# EAGLE design Oscillator_RevA (EAGLE 7.1.0)
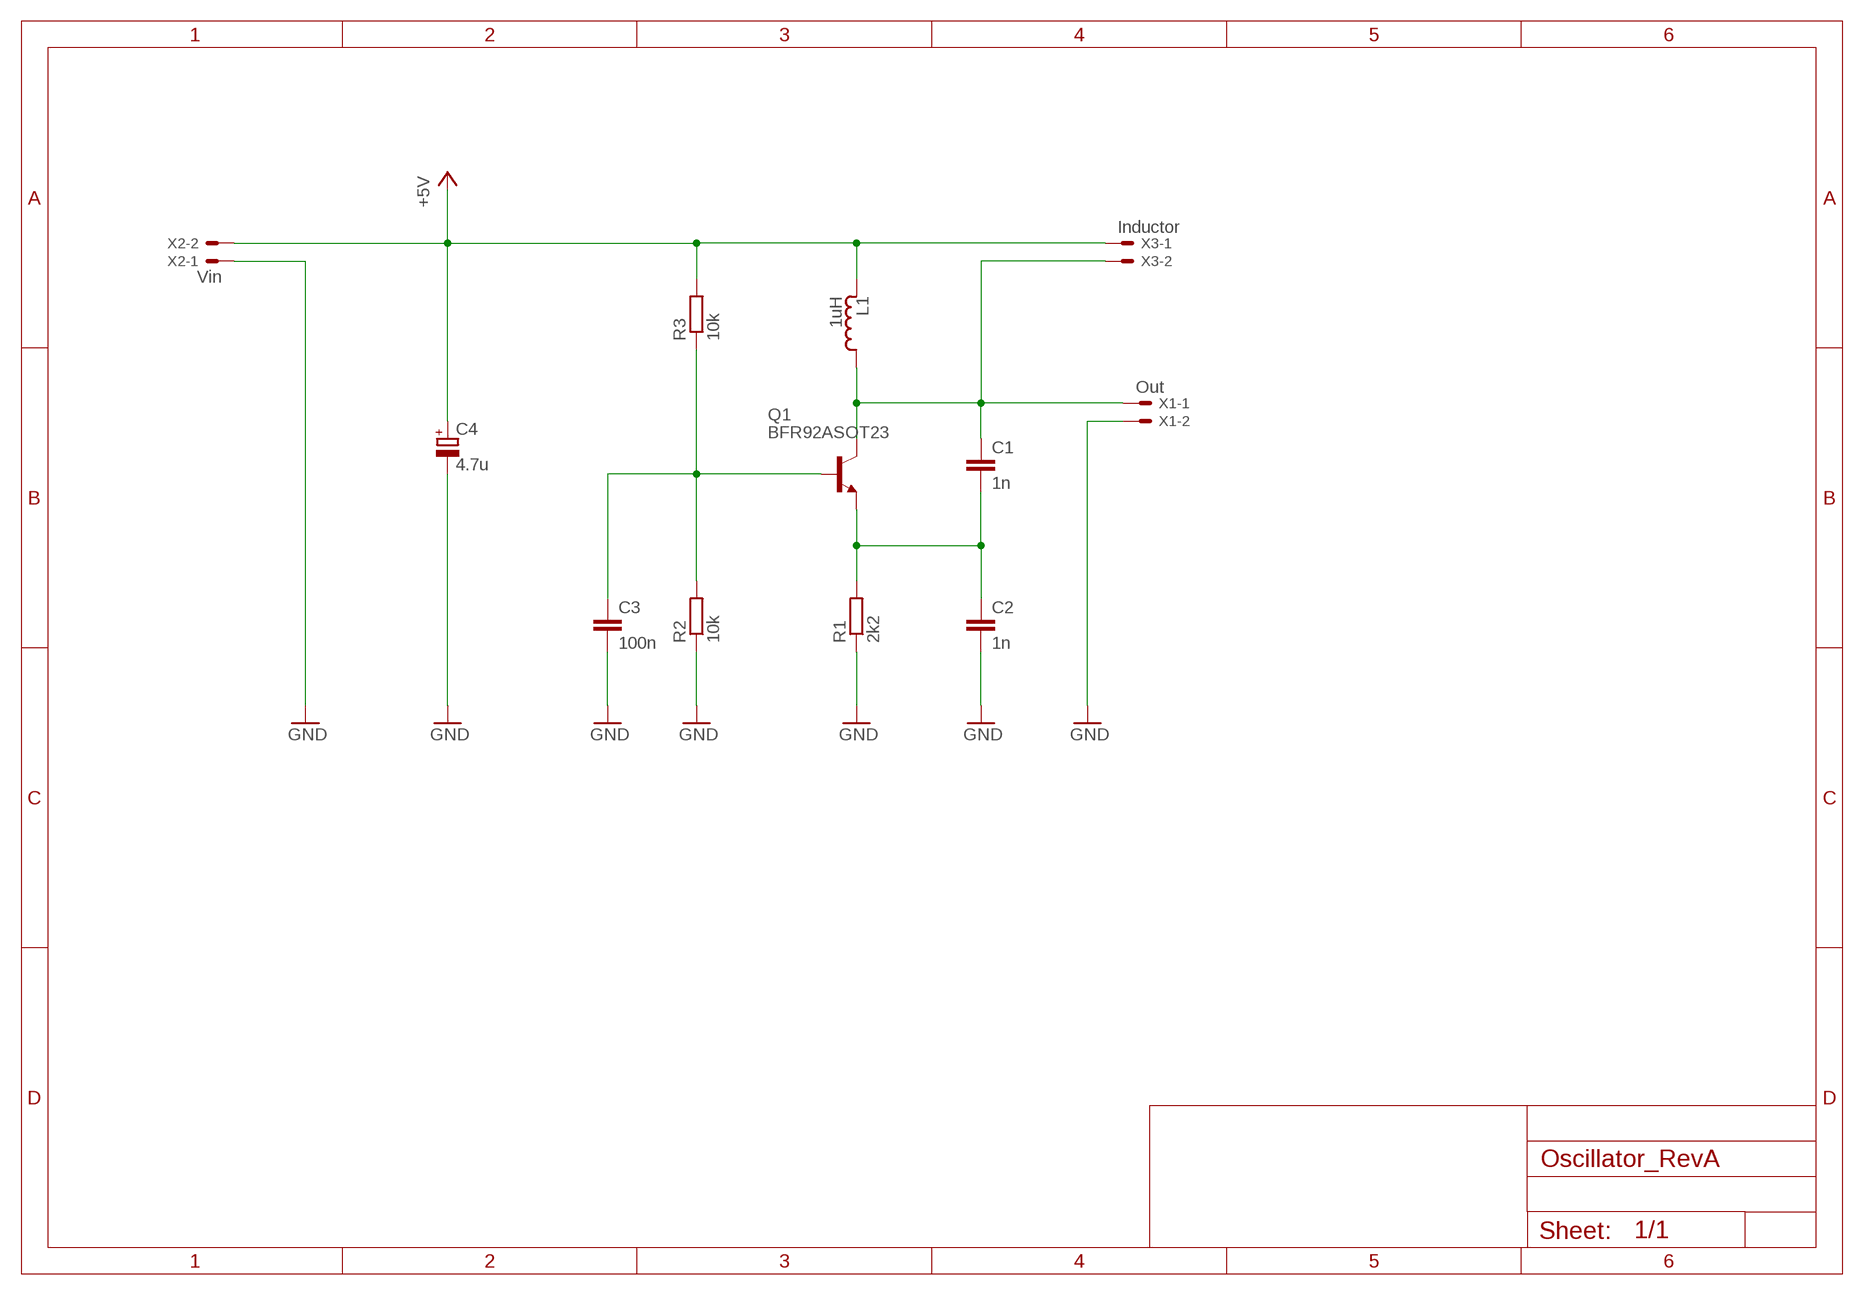
[diagram p0: schematic, sheet 1]

## Parts
C1  1n  CC0805  [C0805]
C2  1n  CC0805  [C0805]
C3  100n  CC0805  [C0805]
C4  4.7u  C_POLARIZEDSMC_C  [SMC_C]
L1  1uH  INDUCTOR4.3MM  [LPS4414]
Q1  BFR92ASOT23  [SOT23]
R1  2k2  RESISTORR0805  [R0805]
R2  10k  RESISTORR0805  [R0805]
R3  10k  RESISTORR0805  [R0805]
X1  Out  22-23-2021100MIL  [22-23-2021]
X2  Vin  22-23-2021100MIL  [22-23-2021]
X3  Inductor  22-23-2021100MIL  [22-23-2021]

## Nets
+5V: C4.+ L1.2 R3.2 X2.2 X3.1
GND: C2.2 C3.2 C4.- R1.1 R2.1 X1.2 X2.1
N$1: C1.1 L1.1 Q1.3(C) X1.1 X3.2
N$2: C1.2 C2.1 Q1.2(E) R1.2
N$3: C3.1 Q1.1(B) R2.2 R3.1

## Library data of the parts
C1-C3 = 00Capacitor:C: Capacitor
C4 = 00Capacitor:C_POLARIZED
L1 = 00Inductor:INDUCTOR
Q1 = 00Transistor:BFR92A
R1-R3 = 00Resistor:RESISTOR: RESISTOR, European symbol
X1-X3 = 00Connector:22-23-2021: .100" (2.54mm) Center Header - 2 Pin; MF: MOLEX; MPN: 22-23-2021; OC_FARNELL: 1462926; OC_NEWARK: 25C3832

## Board
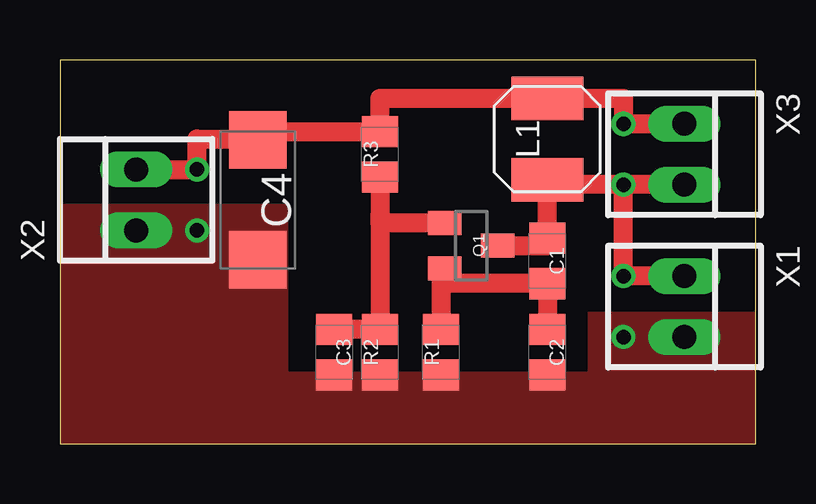
[diagram p1: board, top side]
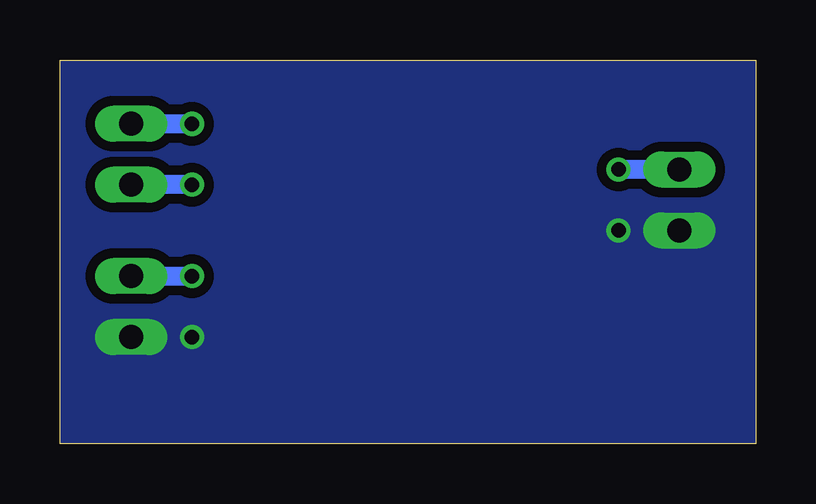
[diagram p2: board, bottom side, seen from below]

Size 29 x 16 mm. Coordinates in mm from the lower left corner, seen from the top.
Outline: 0,0 29,0 29,16 0,16 0,0
Copper layers (1*16): Top 0.035mm / dielectric 1.5mm / Bottom 0.035mm
Design rules "default *": minimum track width 10mil, minimum drill 24mil, track to track 8mil, track to pad 8mil, pad to pad 8mil, via to via 8mil, smd to smd 8mil, copper to edge 0mil, drill to drill 8mil, minimum pad ring 10mil, minimum via ring 8mil, stop-mask expansion 4mil, vias tented up to drill 0mil, thermal gap 10mil

### Footprints (pad centres in the part's own frame; a part is rotated, then mirrored left to right if it is on the bottom)
C0805 = smd 1.3 x 1.5: 1 -0.95,0; 2 0.95,0
SMC_C = smd 2.4 x 2.4: + -2.5,0; - 2.5,0
LPS4414 = smd 1.8 x 3: 1 -1.7,0; 2 1.7,0
SOT23 = smd 1 x 1.4: 1 -0.95,-1.1; 2 0.95,-1.1; 3 0,1.1
R0805 = smd 1.3 x 1.5: 1 -0.95,0; 2 0.95,0
22-23-2021 = drill 1 long: 1 -1.27,0; 2 1.27,0

### Placement (x,y rotation side)
C1  20.32,7.62 270 top
C2  20.32,3.81 270 top
C3  11.43,3.81 270 top
C4  8.26,10.16 270 top
L1  20.32,12.7 90 top
Q1  17.14,8.26 270 top
R1  15.88,3.81 90 top
R2  13.34,3.81 90 top
R3  13.34,12.06 90 top
X1  26.04,5.71 270 top
X2  3.17,10.16 90 top
X3  26.04,12.06 270 top

### Tracks (layer width: path | path; a pad name or v marks a point on that pad's centre or on a via)
+5V  (via drill 0.6)
  Top 0.8: X3.1 v23.5,13.34 23.5,14.4 L1.2 13.34,14.4 R3.2 8.26,13.02 C4.+ 8.26,12.7 5.71,12.7 v5.71,11.43 X2.2
  Bottom 0.8: X3.1 v23.5,13.34 | X2.2 v5.71,11.43
GND  (via drill 0.6)
  other vias: 23.5,4.45 5.71,8.89
  pour Top (isolate 0.4, no thermals): 0,10 9.5,10 9.5,3 22,3 22,5.5 29,5.5 29,0 0,0
  pour Bottom (isolate 0.4, no thermals): 0,0 0,16 29,16 29,0
N$1  (via drill 0.6)
  Top 0.4: 20.32,8.26 C1.1 | 20.32,10.79 L1.1
  Top 0.8: Q1.3 20.32,8.26 | C1.1 L1.1 | X3.2 v23.5,10.79 | v23.5,10.79 20.32,10.79 | X1.1 v23.5,6.99 v23.5,10.79
  Bottom 0.8: v23.5,10.79 X3.2 | X1.1 v23.5,6.99
N$2
  Top 0.4: 15.88,7.3 Q1.2 16.05,6.67
  Top 0.8: 15.88,7.3 R1.2 | C2.1 C1.2 16.05,6.67
N$3
  Top 0.8: R3.1 13.34,9.53 13.34,9.21 | 13.34,9.21 R2.2 C3.1 | Q1.1 13.34,9.21